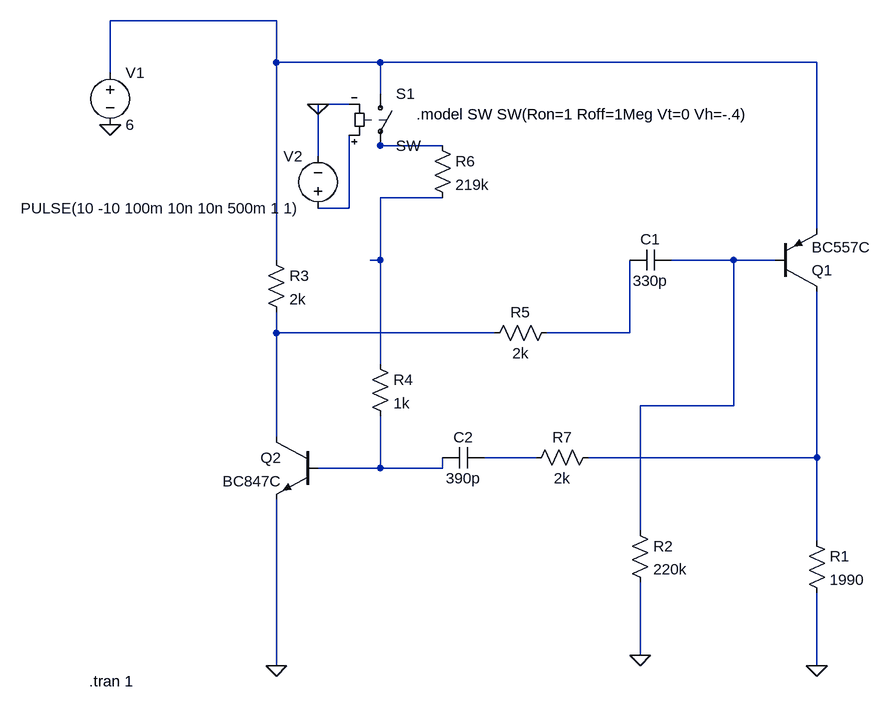
[diagram p0: schematic Horiz multivib.asc]
Horiz multivib.asc, the LTspice schematic file:
Version 4.1
SHEET 1 1000 680
WIRE 16 -768 -240 -768
WIRE 16 -704 16 -768
WIRE 176 -704 16 -704
WIRE 848 -704 176 -704
WIRE -240 -688 -240 -768
WIRE 176 -656 176 -704
WIRE 128 -640 80 -640
WIRE 176 -576 176 -592
WIRE 272 -576 176 -576
WIRE 80 -560 80 -640
WIRE 272 -496 176 -496
WIRE 128 -480 128 -592
WIRE 128 -480 80 -480
WIRE 848 -448 848 -704
WIRE 16 -400 16 -704
WIRE 176 -400 176 -496
WIRE 176 -400 160 -400
WIRE 720 -400 624 -400
WIRE 784 -400 720 -400
WIRE 16 -288 16 -320
WIRE 352 -288 16 -288
WIRE 560 -288 560 -400
WIRE 560 -288 432 -288
WIRE 176 -240 176 -400
WIRE 720 -176 720 -400
WIRE 720 -176 576 -176
WIRE 16 -128 16 -288
WIRE 416 -96 336 -96
WIRE 848 -96 848 -352
WIRE 848 -96 496 -96
WIRE 176 -80 176 -160
WIRE 176 -80 80 -80
WIRE 272 -80 272 -96
WIRE 272 -80 176 -80
WIRE 576 16 576 -176
WIRE 848 32 848 -96
WIRE 576 208 576 96
WIRE 16 224 16 -32
WIRE 848 224 848 112
FLAG 576 208 0
FLAG 16 224 0
FLAG 848 224 0
FLAG -240 -608 0
FLAG 80 -640 0
SYMBOL res 832 16 R0
SYMATTR InstName R1
SYMATTR Value 1990
SYMBOL res 560 0 R0
SYMATTR InstName R2
SYMATTR Value 220k
SYMBOL res 0 -416 R0
SYMATTR InstName R3
SYMATTR Value 2k
SYMBOL res 160 -256 R0
SYMATTR InstName R4
SYMATTR Value 1k
SYMBOL res 448 -304 R90
WINDOW 0 0 56 VBottom 2
WINDOW 3 32 56 VTop 2
SYMATTR InstName R5
SYMATTR Value 2k
SYMBOL voltage -240 -704 R0
WINDOW 123 0 0 Left 0
WINDOW 39 0 0 Left 0
SYMATTR InstName V1
SYMATTR Value 6
SYMBOL res 256 -592 R0
SYMATTR InstName R6
SYMATTR Value 219k
SYMBOL cap 624 -416 R90
WINDOW 0 0 32 VBottom 2
WINDOW 3 32 32 VTop 2
SYMATTR InstName C1
SYMATTR Value 330p
SYMBOL cap 336 -112 R90
WINDOW 0 0 32 VBottom 2
WINDOW 3 32 32 VTop 2
SYMATTR InstName C2
SYMATTR Value 390p
SYMBOL pnp 784 -352 M180
SYMATTR InstName Q1
SYMATTR Value BC557C
SYMBOL npn 80 -128 M0
SYMATTR InstName Q2
SYMATTR Value BC847C
SYMBOL res 512 -112 R90
WINDOW 0 0 56 VBottom 2
WINDOW 3 32 56 VTop 2
SYMATTR InstName R7
SYMATTR Value 2k
SYMBOL sw 176 -672 R0
SYMATTR InstName S1
SYMBOL voltage 80 -464 R180
WINDOW 0 24 96 Left 2
WINDOW 3 24 16 Left 2
WINDOW 123 0 0 Left 0
WINDOW 39 0 0 Left 0
SYMATTR InstName V2
SYMATTR Value PULSE(10 -10 100m 10n 10n 500m 1 1)
TEXT -272 248 Left 2 !.tran 1
TEXT 232 -624 Left 2 !.model SW SW(Ron=1 Roff=1Meg Vt=0 Vh=-.4)

The netlist it stands for:
* Horiz multivib.asc
R1 N009 0 1990
R2 N005 0 220k
R3 N001 N006 2k
R4 N003 N010 1k
R5 N007 N006 2k
V1 N001 0 6
R6 N002 N003 219k
C1 N005 N007 330p
C2 N008 N010 390p
Q1 N009 N005 N001 0 BC557C
Q2 N006 N010 0 0 BC847C
R7 N009 N008 2k
S1 N001 N002 N004 0 SW
V2 N004 0 PULSE(10 -10 100m 10n 10n 500m 1 1)
.model NPN NPN
.model PNP PNP
.lib standard.bjt
.tran 1
.model SW SW(Ron=1 Roff=1Meg Vt=0 Vh=-.4)
.backanno
.end